# EAGLE design logic board Protorype 5_4_ver1 (EAGLE 9.0.0)
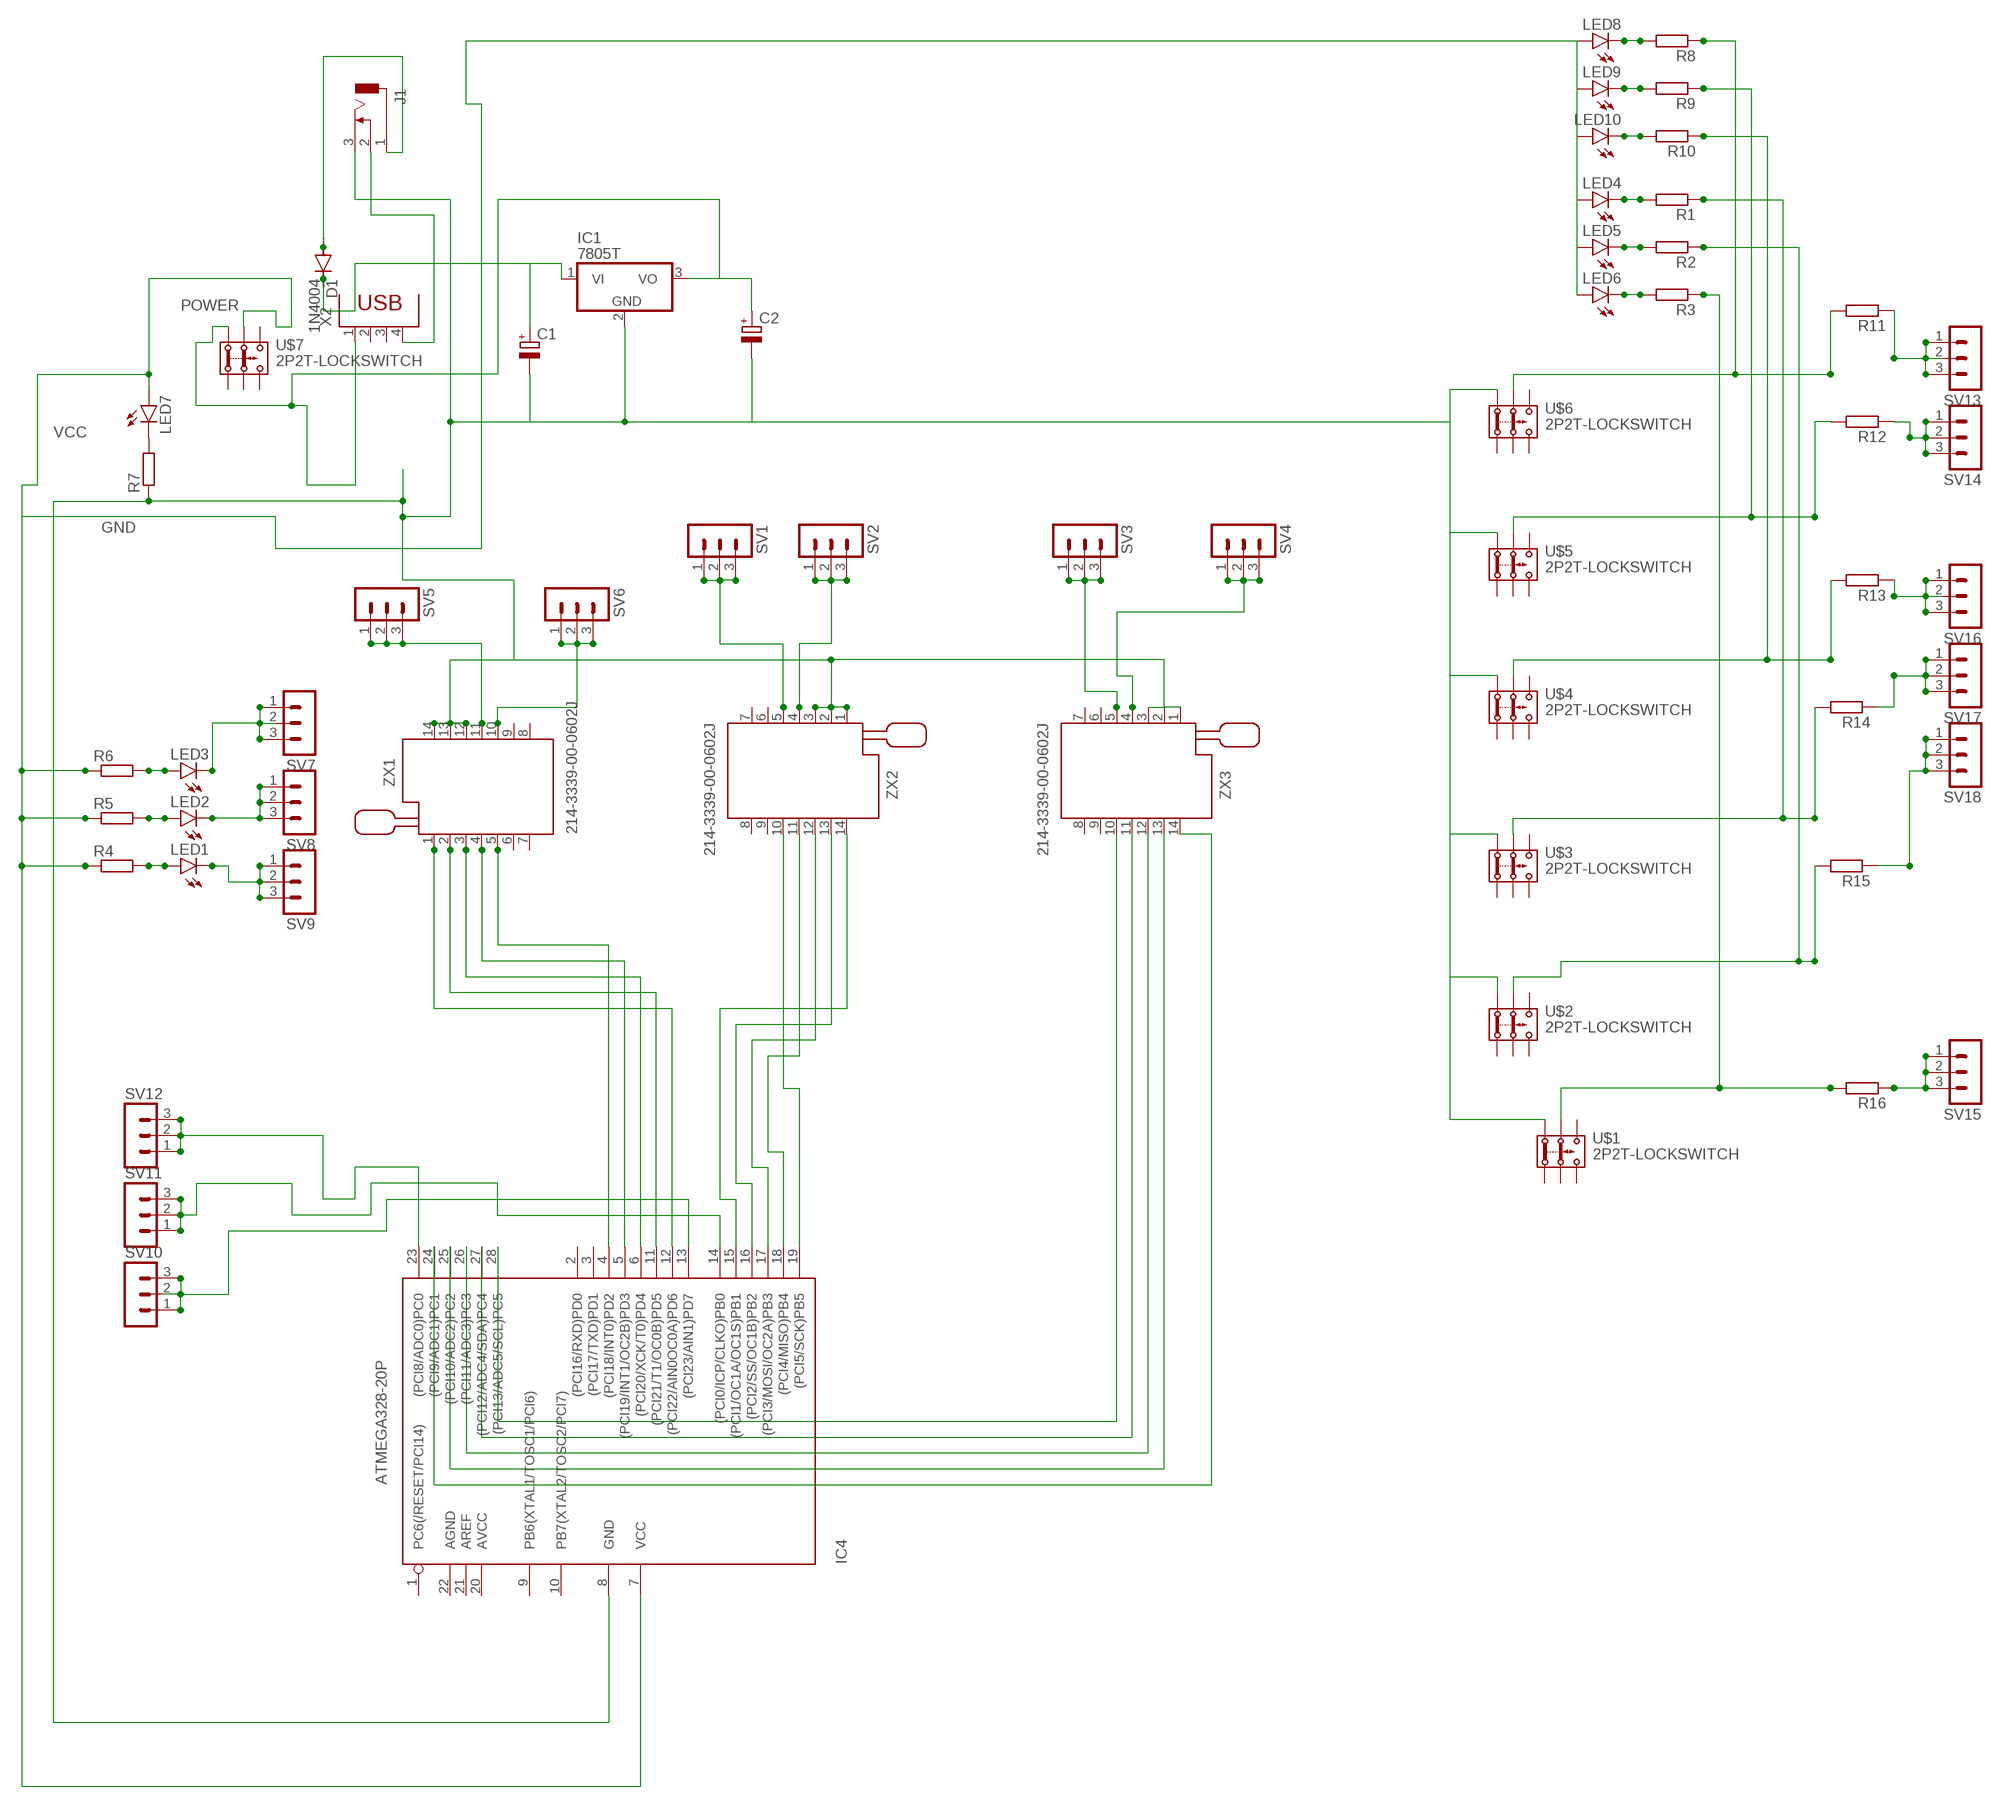
[diagram p0: schematic, sheet 1]

## Parts
C1  CPOL-EUE2.5-6  [E2,5-6]
C2  CPOL-EUE2.5-6  [E2,5-6]
D1  1N4004  [DO41-10]
IC1  7805T  [TO220H]
IC4  ATMEGA328-20P  [DIL28-3]
J1  DCJ0303  [DCJ0303]
LED1  LED5MM  [LED5MM]
LED2  LED5MM  [LED5MM]
LED3  LED5MM  [LED5MM]
LED4  LED5MM  [LED5MM]
LED5  LED5MM  [LED5MM]
LED6  LED5MM  [LED5MM]
LED7  LED5MM  [LED5MM]
LED8  LED5MM  [LED5MM]
LED9  LED5MM  [LED5MM]
LED10  LED5MM  [LED5MM]
R1  R-EU_0207/10  [0207/10]
R2  R-EU_0207/10  [0207/10]
R3  R-EU_0207/10  [0207/10]
R4  R-EU_0207/10  [0207/10]
R5  R-EU_0207/10  [0207/10]
R6  R-EU_0207/10  [0207/10]
R7  R-EU_0207/10  [0207/10]
R8  R-EU_0207/10  [0207/10]
R9  R-EU_0207/10  [0207/10]
R10  R-EU_0207/10  [0207/10]
R11  R-EU_0207/10  [0207/10]
R12  R-EU_0207/10  [0207/10]
R13  R-EU_0207/10  [0207/10]
R14  R-EU_0207/10  [0207/10]
R15  R-EU_0207/10  [0207/10]
R16  R-EU_0207/10  [0207/10]
SV1  MA03-1  [MA03-1]
SV2  MA03-1  [MA03-1]
SV3  MA03-1  [MA03-1]
SV4  MA03-1  [MA03-1]
SV5  MA03-1  [MA03-1]
SV6  MA03-1  [MA03-1]
SV7  MA03-1  [MA03-1]
SV8  MA03-1  [MA03-1]
SV9  MA03-1  [MA03-1]
SV10  MA03-1  [MA03-1]
SV11  MA03-1  [MA03-1]
SV12  MA03-1  [MA03-1]
SV13  MA03-1  [MA03-1]
SV14  MA03-1  [MA03-1]
SV15  MA03-1  [MA03-1]
SV16  MA03-1  [MA03-1]
SV17  MA03-1  [MA03-1]
SV18  MA03-1  [MA03-1]
U$1  2P2T-LOCKSWITCH  [2P2T-LOCKSWITCH]
U$2  2P2T-LOCKSWITCH  [2P2T-LOCKSWITCH]
U$3  2P2T-LOCKSWITCH  [2P2T-LOCKSWITCH]
U$4  2P2T-LOCKSWITCH  [2P2T-LOCKSWITCH]
U$5  2P2T-LOCKSWITCH  [2P2T-LOCKSWITCH]
U$6  2P2T-LOCKSWITCH  [2P2T-LOCKSWITCH]
U$7  2P2T-LOCKSWITCH  [2P2T-LOCKSWITCH]
X2  PN61729  [PN61729]
ZX1  214-3339-00-0602J  [214-3339-00-0602J]
ZX2  214-3339-00-0602J  [214-3339-00-0602J]
ZX3  214-3339-00-0602J  [214-3339-00-0602J]

## Nets
GND: C1.- C2.- IC1.2(GND) IC4.8(GND) J1.3 R7.1 U$1.1.1 U$2.1.1 U$3.1.1 U$4.1.1 U$5.1.1 U$6.1.1 ZX1.12 ZX1.13 ZX1.14 ZX2.1 ZX2.2 ZX2.3 ZX3.1 ZX3.2 ZX3.3
N$1: IC4.13((PCI23/AIN1)PD7) SV10.1 SV10.2 SV10.3
N$2: IC4.5((PCI19/INT1/OC2B)PD3) ZX1.4
N$3: LED5.K(C) R2.2
N$4: IC4.15((PCI1/OC1A/OC1S)PB1) ZX2.14
N$5: IC4.16((PCI2/SS/OC1B)PB2) ZX2.13
N$6: IC4.17((PCI3/MOSI/OC2A)PB3) ZX2.12
N$7: IC4.28((PCI13/ADC5/SCL)PC5) ZX3.10
N$8: IC4.24((PCI9/ADC1)PC1) ZX3.14
N$9: IC4.18((PCI4/MISO)PB4) ZX2.11
N$10: IC4.25((PCI10/ADC2)PC2) ZX3.13
N$11: IC4.19((PCI5/SCK)PB5) ZX2.10
N$12: IC4.23((PCI8/ADC0)PC0) SV12.1 SV12.2 SV12.3
N$13: LED6.K(C) R3.2
N$14: SV5.1 SV5.2 SV5.3 ZX1.11
N$15: IC4.27((PCI12/ADC4/SDA)PC4) ZX3.11
N$16: IC4.6((PCI20/XCK/T0)PD4) ZX1.3
N$17: LED2.K(C) SV8.1 SV8.2 SV8.3
N$18: LED3.A R6.2
N$19: LED2.A R5.2
N$20: SV6.1 SV6.2 SV6.3 ZX1.10
N$21: LED3.K(C) SV7.1 SV7.2 SV7.3
N$22: LED1.A R4.2
N$23: IC4.11((PCI21/T1/OC0B)PD5) ZX1.2
N$24: IC4.14((PCI0/ICP/CLKO)PB0) SV11.1 SV11.2 SV11.3
N$25: IC4.4((PCI18/INT0)PD2) ZX1.5
N$26: SV1.1 SV1.2 SV1.3 ZX2.5
N$27: SV4.1 SV4.2 SV4.3 ZX3.4
N$28: LED1.K(C) SV9.1 SV9.2 SV9.3
N$29: SV3.1 SV3.2 SV3.3 ZX3.5
N$30: SV2.1 SV2.2 SV2.3 ZX2.4
N$31: IC4.26((PCI11/ADC3)PC3) ZX3.12
N$32: LED7.K(C) R7.2
N$33: LED4.K(C) R1.2
N$34: R8.1 R11.2 U$6.2.1
N$35: IC4.12((PCI22/AIN0OC0A)PD6) ZX1.1
N$36: R9.1 R12.2 U$5.2.1
N$37: R3.1 R16.2 U$1.2.1
N$38: LED9.K(C) R9.2
N$39: LED10.K(C) R10.2
N$40: LED8.K(C) R8.2
N$41: R10.1 R13.2 U$4.2.1
N$43: R2.1 R15.2 U$2.2.1
N$44: R11.1 SV13.1 SV13.2 SV13.3
N$45: R1.1 R14.2 U$3.2.1
N$46: R12.1 SV14.1 SV14.2 SV14.3
N$47: R13.1 SV16.1 SV16.2 SV16.3
N$48: R14.1 SV17.1 SV17.2 SV17.3
N$49: R15.1 SV18.1 SV18.2 SV18.3
N$50: R16.1 SV15.1 SV15.2 SV15.3
N$51: J1.2 X2.4
N$52: D1.A J1.1
N$54: C1.+ D1.C IC1.1(VI)
POWER: C2.+ IC1.3(VO) U$7.1.1 X2.1
VCC: IC4.7(VCC) LED4.A LED5.A LED6.A LED7.A LED8.A LED9.A LED10.A R4.1 R5.1 R6.1 U$7.2.1
Unconnected: IC4.1(PC6(/RESET/PCI14)) IC4.2((PCI16/RXD)PD0) IC4.3((PCI17/TXD)PD1) IC4.9(PB6(XTAL1/TOSC1/PCI6)) IC4.10(PB7(XTAL2/TOSC2/PCI7)) IC4.20(AVCC) IC4.21(AREF) IC4.22(AGND) U$1.1.2 U$1.2.2 U$1.3.1 U$1.3.2 U$2.1.2 U$2.2.2 U$2.3.1 U$2.3.2 U$3.1.2 U$3.2.2 U$3.3.1 U$3.3.2 U$4.1.2 U$4.2.2 U$4.3.1 U$4.3.2 U$5.1.2 U$5.2.2 U$5.3.1 U$5.3.2 U$6.1.2 U$6.2.2 U$6.3.1 U$6.3.2 U$7.1.2 U$7.2.2 U$7.3.1 U$7.3.2 X2.2 X2.3 ZX1.6 ZX1.7 ZX1.8 ZX1.9 ZX2.6 ZX2.7 ZX2.8 ZX2.9 ZX3.6 ZX3.7 ZX3.8 ZX3.9

## Library data of the parts
C1 C2 = resistor:CPOL-EU: POLARIZED CAPACITOR, European symbol
D1 = diode:1N4004: DIODE general purpose rectifier, 1 A
IC1 = linear:78*: Positive VOLTAGE REGULATOR Source: http://cache.national.com/ds/LM/LM78L05.pdf http://www.fairchildsemi.com/ds/LM/LM7805.pdf
IC4 = atmega328:ATMEGA328*P: MICROCONTROLLER 32 kBytes FLASH 2 kBytes SRAM 1 kBytes EEPROM USART 8-channel 10 bit ADC
J1 = con-jack:DCJ0303: DC POWER JACK Source: DCJ0303.pdf; OC_FARNELL: unknown; OC_NEWARK: unknown
LED1-LED10 = led:LED: LED OSRAM: - CHIPLED LG R971, LG N971, LY N971, LG Q971, LY Q971, LO R971, LY R971 LH N974, LH R974 LS Q976, LO Q976, LY Q976 LO Q996 - Hyper CHIPLED LW Q18S LB Q993, LB Q99A, LB R99A - SideLED LS A670, LO A670, LY A670, LG A670, LP A670 LB A673, LV A673, LT A673, LW A673 LH A674 LY A675 LS A676, LA A676, LO A676, LY A676, LW A676 LS A679, LY A679, LG A679 - Hyper Micro SIDELED® LS Y876, LA Y876, LO Y876, LY Y876 LT Y87S - SmartLED LW L88C, LW L88S LB L89C, LB L89S, LG L890 LS L89K, LO L89K, LY L89K LS L896, LA L896, LO L896, LY L896 - TOPLED LS T670, LO T670, LY T670, LG T670, LP T670 LSG T670, LSP T670, LSY T670, LOP T670, LYG T670 LG T671, LOG T671, LSG T671 LB T673, LV T673, LT T673, LW T673 LH T674 LS T676, LA T676, LO T676, LY T676, LB T676, LH T676, LSB T676, LW T676 LB T67C, LV T67C, LT T67C, LS T67K, LO T67K, LY T67K, LW E67C LS E67B, LA E67B, LO E67B, LY E67B, LB E67C, LV E67C, LT E67C LW T67C LS T679, LY T679, LG T679 LS T770, LO T770, LY T770, LG T770, LP T770 LB T773, LV T773, LT T773, LW T773 LH T774 LS E675, LA E675, LY E675, LS T675 LS T776, LA T776, LO T776, LY T776, LB T776 LHGB T686 LT T68C, LB T68C - Hyper Mini TOPLED® LB M676 - Mini TOPLED Santana® LG M470 LS M47K, LO M47K, LY M47K Source: http://www.osram.convergy.de LUXEON: - LUMILED® LXK2-PW12-R00, LXK2-PW12-S00, LXK2-PW14-U00, LXK2-PW14-V00 LXK2-PM12-R00, LXK2-PM12-S00, LXK2-PM14-U00 LXK2-PE12-Q00, LXK2-PE12-R00, LXK2-PE12-S00, LXK2-PE14-T00, LXK2-PE14-U00 LXK2-PB12-K00, LXK2-PB12-L00, LXK2-PB12-M00, LXK2-PB14-N00, LXK2-PB14-P00, LXK2-PB14-Q00 LXK2-PR12-L00, LXK2-PR12-M00, LXK2-PR14-Q00, LXK2-PR14-R00 LXK2-PD12-Q00, LXK2-PD12-R00, LXK2-PD12-S00 LXK2-PH12-R00, LXK2-PH12-S00 LXK2-PL12-P00, LXK2-PL12-Q00, LXK2-PL12-R00 Source: www.luxeon.com KINGBRIGHT: KA-3528ASYC Source: www.kingbright.com
R1-R16 = rcl:R-EU_: RESISTOR, European symbol; SPICEPREFIX: R
SV1-SV18 = con-lstb:MA03-1: PIN HEADER; OC_FARNELL: unknown; OC_NEWARK: unknown
U$1-U$7 = switch:2P2T-LOCKSWITCH
X2 = con-berg:PN61729: BERG USB connector; OC_FARNELL: unknown; OC_NEWARK: unknown
ZX1-ZX3 = con-3m:214-3339-00-0602J: Zero Insertion Force Socked Source: http://www.3M.com/ehpd; MF: 3M; MPN: 214-3339-00-0602J; OC_FARNELL: 1247151; OC_NEWARK: 85K7793

## Net classes
0 default: width 0.762 mm, clearance 1.143 mm

## Board
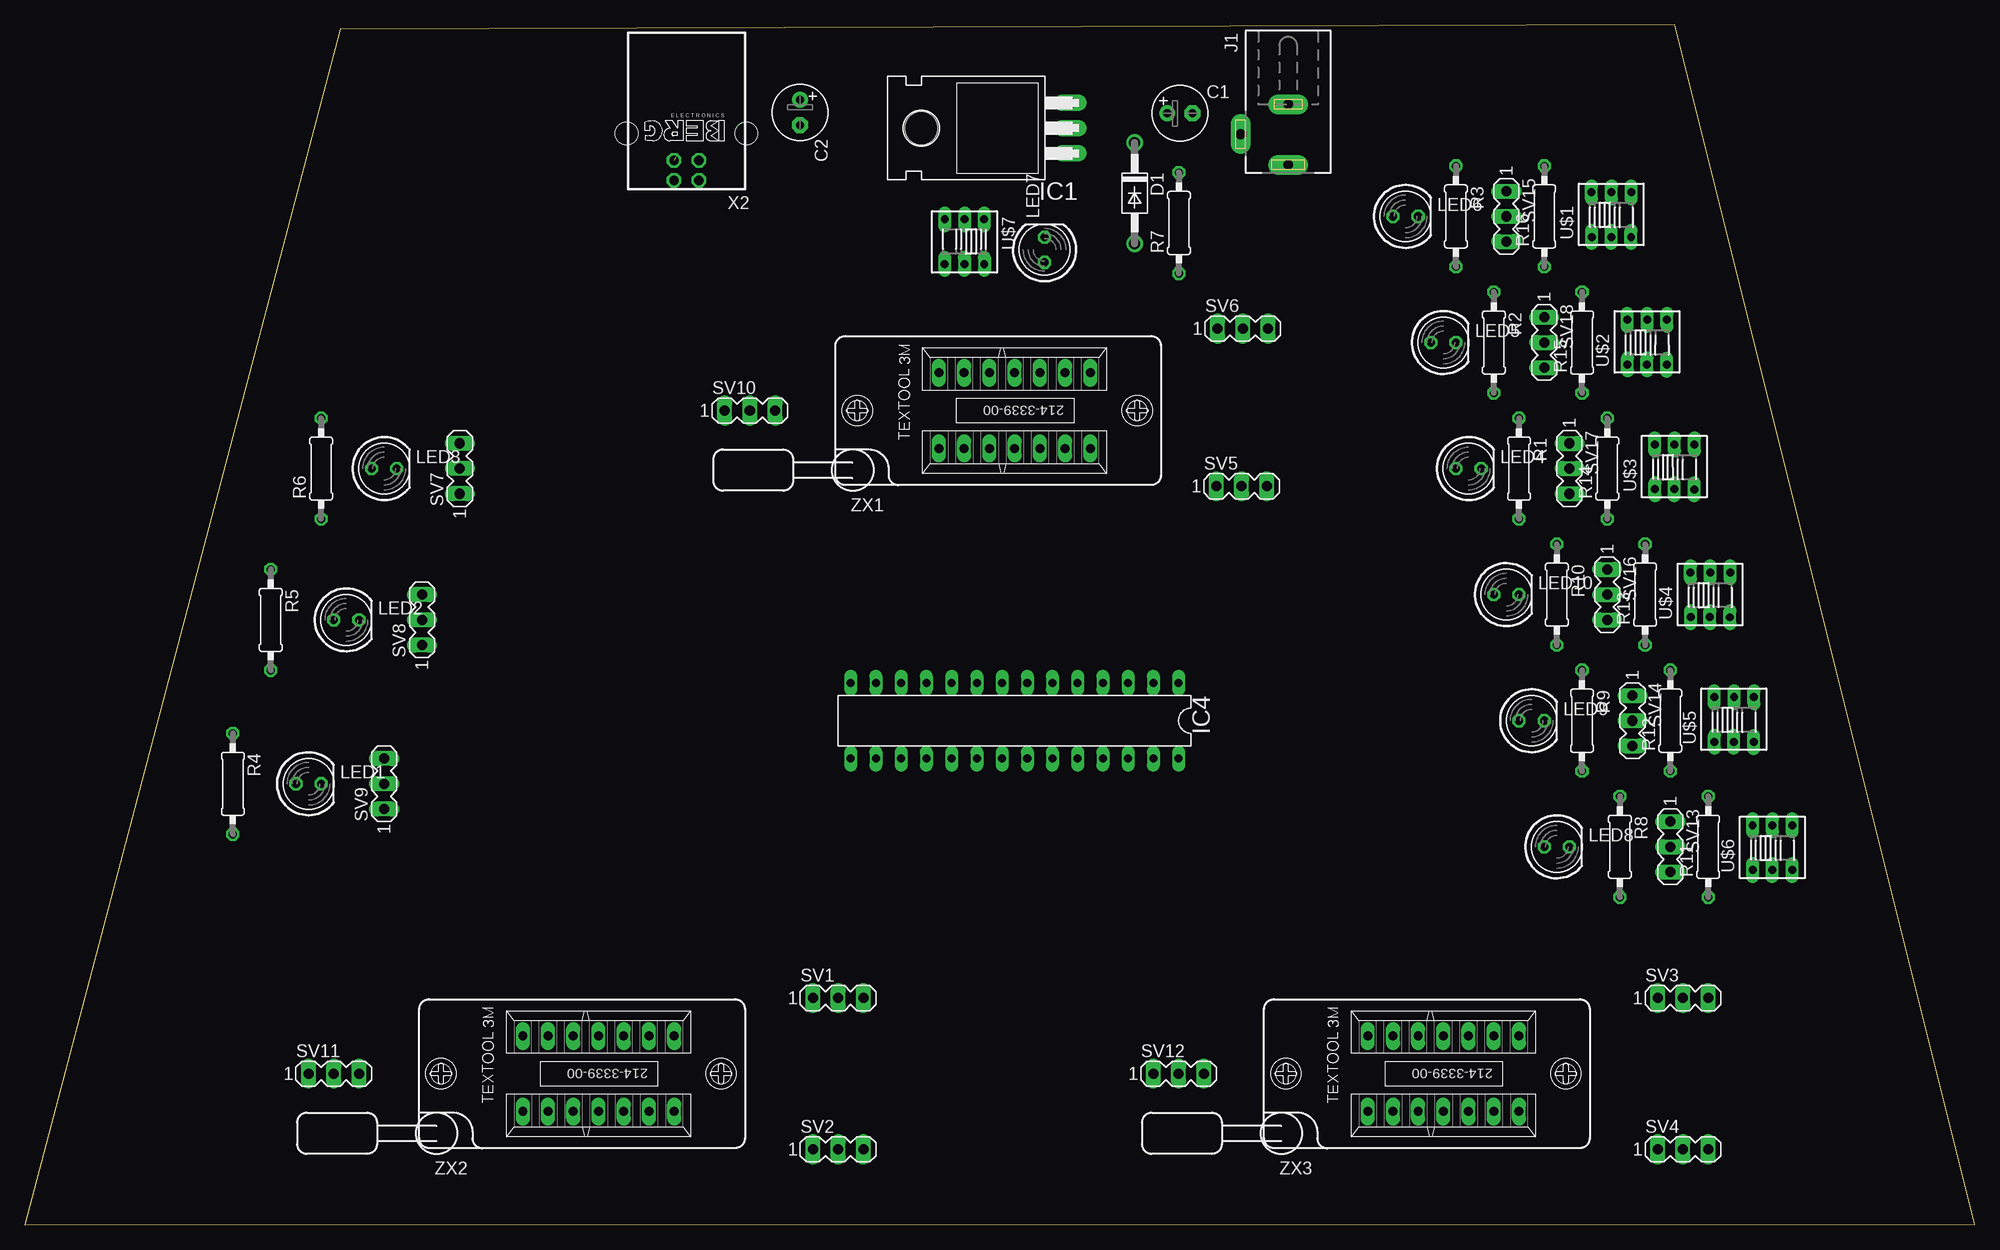
[diagram p1: board, top side]
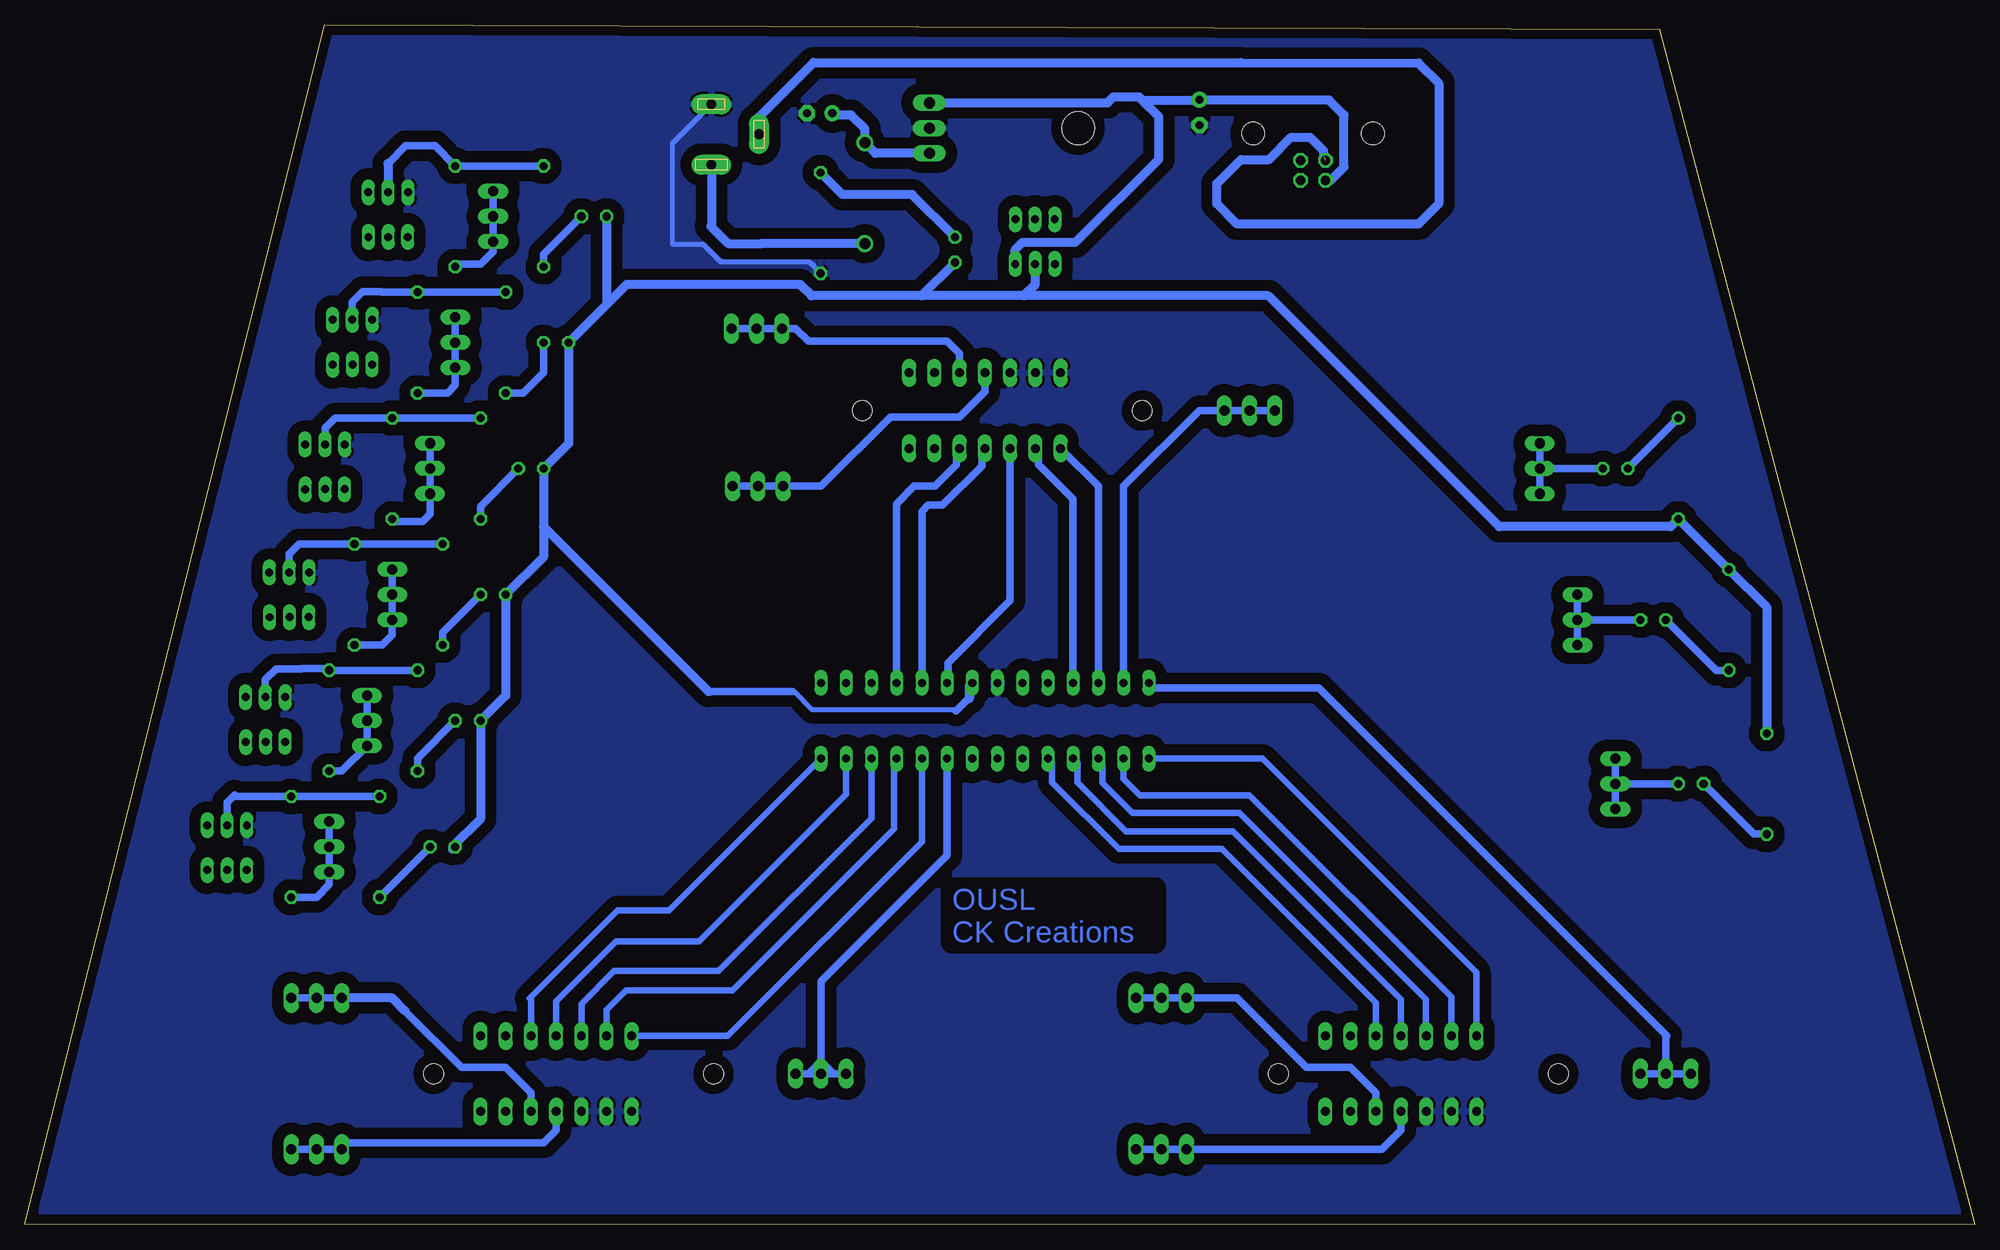
[diagram p2: board, bottom side, seen from below]

Size 196.39 x 120.9 mm. Coordinates in mm from the lower left corner, seen from the top.
Outline: 0,0 196.39,0.08 166.18,120.9 31.78,120.44 0,0
Copper layers (1*16): Top 0.035mm / dielectric 1.5mm / Bottom 0.035mm
Design rules "default": minimum track width 6mil, minimum drill 0.35mm, track to track 6mil, track to pad 6mil, pad to pad 6mil, via to via 6mil, smd to smd 6mil, copper to edge 40mil, drill to drill 6mil, minimum pad ring 10mil, minimum via ring 8mil, stop-mask expansion 4mil, vias tented up to drill 0mil, thermal gap 10mil

### Footprints (pad centres in the part's own frame; a part is rotated, then mirrored left to right if it is on the bottom)
E2,5-6 = drill 0.813 pad 1.6: + -1.27,0 | drill 0.813 pad 1.6 octagon: - 1.27,0
DO41-10 = drill 1.118: A 5.08,0; C -5.08,0
TO220H = drill 1.118 long: 1 -2.54,-10.16; 2 0,-10.16; 3 2.54,-10.16 | hole 3.302: 0,4.826
DIL28-3 = drill 0.813 long: 1 -16.51,-3.81; 2 -13.97,-3.81; 3 -11.43,-3.81; 4 -8.89,-3.81; 5 -6.35,-3.81; 6 -3.81,-3.81; 7 -1.27,-3.81; 8 1.27,-3.81; 9 3.81,-3.81; 10 6.35,-3.81; 11 8.89,-3.81; 12 11.43,-3.81; 13 13.97,-3.81; 14 16.51,-3.81; 15 16.51,3.81; 16 13.97,3.81; 17 11.43,3.81; 18 8.89,3.81; 19 6.35,3.81; 20 3.81,3.81; 21 1.27,3.81; 22 -1.27,3.81; 23 -3.81,3.81; 24 -6.35,3.81; 25 -8.89,3.81; 26 -11.43,3.81; 27 -13.97,3.81; 28 -16.51,3.81
DCJ0303 = drill 1 pad 2 long: 1 0,3.1; 2 4.8,0; 3 0,-3
LED5MM = drill 0.813 octagon: A -1.27,0; K 1.27,0
0207/10 = drill 0.813 octagon: 1 -5.08,0; 2 5.08,0
MA03-1 = drill 1.016 long: 1 -2.54,0; 2 0,0; 3 2.54,0
2P2T-LOCKSWITCH = drill 0.8 pad 0.965 long: 1.1 -1.98,1.99; 1.2 -1.96,-2.52; 2.1 0.02,1.99; 2.2 -0.01,-2.52; 3.1 2.02,1.99; 3.2 2,-2.53
PN61729 = drill 0.95 octagon: 1 1.25,4.71; 2 -1.25,4.71; 3 -1.25,2.71; 4 1.25,2.71 | hole 2.3: -6.02,0; 6.02,0
214-3339-00-0602J = drill 0.9 long: 1 -7.62,-3.81; 2 -5.08,-3.81; 3 -2.54,-3.81; 4 0,-3.81; 5 2.54,-3.81; 6 5.08,-3.81; 7 7.62,-3.81; 8 7.62,3.81; 9 5.08,3.81; 10 2.54,3.81; 11 0,3.81; 12 -2.54,3.81; 13 -5.08,3.81; 14 -7.62,3.81 | hole 2: 12.35,0; -15.85,0

### Placement (x,y rotation side)
C1  116.33,111.98 0 top
C2  78.08,112.07 270 top
D1  111.78,103.94 270 top
IC1  95.12,110.49 90 top
IC4  99.7,50.8 180 top
J1  127.25,109.89 180 top
LED1  28.57,44.45 0 top
LED2  32.39,60.96 0 top
LED3  36.2,76.2 0 top
LED4  145.41,76.2 0 top
LED5  142.88,88.9 0 top
LED6  139.06,101.6 0 top
LED7  102.71,98.24 90 top
LED8  154.3,38.1 0 top
LED9  151.76,50.8 0 top
LED10  149.22,63.5 0 top
R1  150.49,76.2 270 top
R2  147.95,88.9 270 top
R3  144.14,101.6 270 top
R4  20.96,44.45 270 top
R5  24.76,60.96 270 top
R6  29.85,76.2 90 top
R7  116.24,100.94 90 top
R8  160.66,38.1 270 top
R9  156.84,50.8 270 top
R10  154.3,63.5 270 top
R11  169.54,38.1 90 top
R12  165.73,50.8 90 top
R13  163.19,63.5 90 top
R14  159.38,76.2 90 top
R15  156.84,88.9 90 top
R16  153.03,101.6 90 top
SV1  81.92,22.86 0 top
SV2  81.92,7.62 0 top
SV3  167,22.86 0 top
SV4  167,7.62 0 top
SV5  122.55,74.42 0 top
SV6  122.67,90.3 0 top
SV7  43.81,76.2 90 top
SV8  40,60.96 90 top
SV9  36.2,44.45 90 top
SV10  73.03,82.04 0 top
SV11  31.11,15.24 0 top
SV12  116.2,15.24 0 top
SV13  165.73,38.1 270 top
SV14  161.92,50.8 270 top
SV15  149.22,101.6 270 top
SV16  159.38,63.5 270 top
SV17  155.57,76.2 270 top
SV18  153.03,88.9 270 top
U$1  159.78,102.04 0 top
U$2  163.38,89.2 0 top
U$3  166.14,76.63 0 top
U$4  169.74,63.75 0 top
U$5  172.14,51.19 0 top
U$6  176,38.28 0 top
U$7  94.65,98.78 180 top
X2  66.64,109.95 180 top
ZX1  99.7,82.04 0 top
ZX2  57.79,15.24 0 top
ZX3  142.88,15.24 0 top

### Tracks (layer width: path | path; a pad name or v marks a point on that pad's centre or on a via)
GND
  Bottom 0.508: 116.97,96.77 116.97,96.59 R7.1 117.4,97.02 126.31,97.02 128.09,98.81 131.19,98.81 131.19,108.94 J1.3
  Bottom 0.762: ZX3.2
  pour Bottom: 31.64,120.65 165.85,120.65 196.85,0 -0.63,0
N$1
  Bottom 0.762: IC4.13 85.73,74.42 78.11,82.04 SV10.3 SV10.2 SV10.1
N$2
  Bottom 0.762: IC4.5 106.05,71.88 105.41,72.52 103.94,72.52 100.01,76.45 100.01,77.92 ZX1.4
N$3
  Bottom 0.762: R2.2 146.18,83.82 144.14,85.85 LED5.K
N$4
  Bottom 0.635: IC4.15 71.73,46.99 50.2,25.46 50.2,19.08 ZX2.14
N$5
  Bottom 0.635: IC4.16 85.73,44.93 84.08,43.29 73.03,43.29 52.7,22.97 ZX2.13
N$6
  Bottom 0.635: IC4.17 87.85,46.57 87.85,44.54 84.81,41.51 74.04,41.51 55.26,22.73 55.26,19.06 ZX2.12
N$7
  Bottom 0.635: IC4.28 131.5,31.7 136.68,31.7 145.56,22.81 145.41,22.67 ZX3.10
N$8
  Bottom 0.635: IC4.24 106.05,38.61 125.6,19.05 ZX3.14
N$9
  Bottom 0.635: IC4.18 90.39,46.57 90.39,44.56 85.47,39.65 74.69,39.65 57.79,22.74 ZX2.11
N$10
  Bottom 0.635: IC4.25 108.84,46.74 108.84,39.88 125.1,23.62 135.85,23.62 137.79,21.68 ZX3.13
N$11
  Bottom 0.635: IC4.19 92.93,46.57 92.93,44.59 86.21,37.87 75.8,37.87 60.33,22.4 ZX2.10
N$12
  Bottom 0.762: SV12.2 114.94,15.24 | 114.94,15.24 SV12.1 | SV12.2 117.48,15.24 | 117.48,15.24 SV12.3 | 116.2,16.51 114.94,15.24 | SV12.2 116.2,16.51 | 116.2,16.51 117.48,15.24 | IC4.23 103.51,37.23 104.34,36.39 104.36,36.39 116.2,24.55 SV12.2
N$13
  Bottom 0.762: R3.2 144.14,97.79 LED6.K
N$14
  Bottom 0.762: ZX1.11 99.7,83.95 102.23,81.41 109.22,81.41 116.2,74.42 SV5.1 SV5.2 SV5.3
N$15
  Bottom 0.635: IC4.27 113.67,43.39 128.49,28.56 136.85,28.56 142.88,22.54 ZX3.11
N$16
  Bottom 0.762: ZX1.3 97.16,62.88 103.41,56.63 103.41,54.71 IC4.6
N$17
  Bottom 0.762: SV8.2 LED2.K | SV8.2 SV8.1 | SV8.2 SV8.3
N$18
  Bottom 0.762: LED3.A R6.2
N$19
  Bottom 0.762: R5.2 26.04,55.88 LED2.A
N$20
  Bottom 0.762: ZX1.10 102.23,87.76 103.51,89.03 117.48,89.03 118.75,90.3 SV6.1 SV6.2 SV6.3
N$21
  Bottom 0.762: SV7.2 LED3.K | SV7.2 SV7.1 | SV7.2 SV7.3
N$22
  Bottom 0.762: R4.2 22.22,39.37 LED1.A
N$23
  Bottom 0.762: ZX1.2 94.3,77.92 94.3,76.61 90.81,73.11 IC4.11
N$24
  Bottom 0.762: IC4.14 82.68,54.1 66.04,54.1 30.99,19.05 31.11,18.92 SV11.2 | SV11.1 SV11.2 | SV11.2 SV11.3
N$25
  Bottom 0.762: IC4.4 108.59,72.64 106.81,74.42 104.73,74.42 102.55,76.61 102.55,77.92 ZX1.5
N$26
  Bottom 0.762: ZX2.5 60.33,13.33 62.87,15.87 67.31,15.87 74.3,22.86 SV1.1 SV1.2 SV1.3
N$27
  Bottom 0.762: ZX3.4 142.88,9.52 144.14,8.25 163.83,8.25 SV4.1 SV4.2 SV4.3
N$28
  Bottom 0.762: SV9.2 LED1.K | SV9.2 SV9.1 | SV9.2 SV9.3
N$29
  Bottom 0.762: ZX3.5 145.41,13.33 147.95,15.87 152.4,15.87 158.11,21.59 | SV3.1 SV3.2 SV3.3
  Bottom 0.889: 158.11,21.59 159.38,22.86 SV3.1
N$30
  Bottom 0.762: ZX2.4 57.79,9.52 59.69,7.62 SV2.1 SV2.2 SV2.3
N$31
  Bottom 0.635: IC4.26 111.13,40.97 126.51,25.59 137.03,25.59 140.33,22.29 ZX3.12
N$32
  Bottom 0.889: LED7.K 107.02,103.81 114.02,103.81 R7.2
N$33
  Bottom 0.762: R1.2 150.49,72.39 LED4.K
N$34
  Bottom 0.762: R8.1 R11.2 175.1,43.18 175.24,43.33 176.02,42.55 176.02,42 | 176.02,42 | U$6.2.1 176.02,42
N$35
  Bottom 0.762: IC4.12 88.27,74.42 ZX1.1
N$36
  Bottom 0.762: R9.1 R12.2 165.93,56.08 168.5,56.08 168.57,56.01 171.08,56.01 172.16,54.93 U$5.2.1
N$37
  Bottom 0.762: R3.1 R16.2 155.07,108.71 157.61,108.71 158.02,108.71 159.8,106.93
  Bottom 0.889: 159.8,106.93 U$1.2.1
N$38
  Bottom 0.762: R9.2 156.84,46.99 LED9.K
N$39
  Bottom 0.762: R10.2 154.3,59.69 LED10.K
N$40
  Bottom 0.762: R8.2 LED8.K
N$41
  Bottom 0.762: R10.1 R13.2 168.77,68.58 169.76,67.59 U$4.2.1
N$42  (via drill 1.25 pad 2.32)
  other vias: 72.65,109.96
N$43
  Bottom 0.762: R2.1 R15.2 160.46,93.98 160.5,94.02 162.36,94.02 163.4,92.98 163.4,92.92 U$2.2.1
N$44
  Bottom 0.762: R11.1 167,33.02 165.73,34.29 SV13.3 SV13.2 SV13.1
N$45
  Bottom 0.762: R1.1 R14.2 165.14,81.28 166.16,80.27 U$3.2.1
N$46
  Bottom 0.762: R12.1 164.47,45.72 SV14.3 SV14.2 SV14.1
N$47
  Bottom 0.762: R13.1 160.4,58.42 159.38,59.44 SV16.3 SV16.2 SV16.1
N$48
  Bottom 0.762: R14.1 159.13,70.87 156.34,70.87 155.57,71.63 SV17.3 SV17.2 SV17.1
N$49
  Bottom 0.762: R15.1 153.8,83.82 153.03,84.58 SV18.3 SV18.2 SV18.1
N$50
  Bottom 0.762: R16.1 152.78,96.77 150.49,96.77 149.22,98.04 SV15.3 149.22,100.84 SV15.2 SV15.1
N$51  (1 unrouted)
  Bottom 0.889: 65.58,107.56 65.54,107.56 65.58,107.59 65.58,108.2 66.93,109.55 68.85,109.55 71.07,107.34 73.89,107.34 76.33,104.9 76.33,102.87 74.3,100.84 56.01,100.84 53.98,102.87 53.98,115 56.01,117.03 73.92,117.09 116.97,117.09 122.45,111.62 J1.2
N$52
  Bottom 0.889: D1.A 121.72,98.86 122.15,98.86 125.54,98.86 127.3,100.62 127.24,100.67 J1.1
N$54
  Bottom 0.889: IC1.1 110.72,107.96 D1.C 111.78,110.42 113.16,111.8 114.89,111.8 C1.+
N$55  (via drill 1.25 pad 2.32)
  other vias: 60.6,109.94
POWER
  Bottom 0.889: X2.1 64.84,105.24 63.51,106.57 63.51,111.81 65.02,113.33 C2.+ | C2.+ | IC1.3 87.34,113.04 86.75,113.64 84.17,113.64 83.87,113.33 | 83.87,113.33 C2.+ | 83.87,113.33 82.18,111.64 82.18,107.39 90.57,98.99 95.89,98.99 96.64,98.24 U$7.1.1
VCC
  Bottom 0.508: 102.6,51.77 102.73,51.89 117.06,51.89 118.89,53.72 119.07,53.72
  Bottom 0.762: 101.26,54.1 101.32,54.04 101.32,53.05 102.6,51.77 | 119.07,53.72 127.51,53.72
  Bottom 0.889: LED6.A 137.79,92.71 | 137.79,92.71 LED5.A 141.6,78.74 LED4.A 144.14,70.36 | 144.14,70.36 144.14,67.31 LED10.A 147.95,53.34 LED9.A 150.49,40.89 153.33,38.06 153.33,37.85 153.07,38.1 LED8.A | IC4.7 101.26,54.32 101.26,54.1 101.26,53.02 | 127.51,53.72 144.14,70.36 | LED7.A 106.07,93.61 | 106.07,93.61 117.17,93.61 118.3,94.74 135.76,94.74 137.79,92.71 | U$7.2.1 94.64,94.76 94.62,94.74 95.74,93.61 | 95.74,93.61 106.07,93.61 | R4.1 20.96,62.23 R5.1 R6.1 30.61,70.36 47.88,70.36 71.14,93.61 95.74,93.61

### Text on the board
Bottom: OUSL / CK Creations